# EAGLE design HMVCO1 (EAGLE 9.6.2)
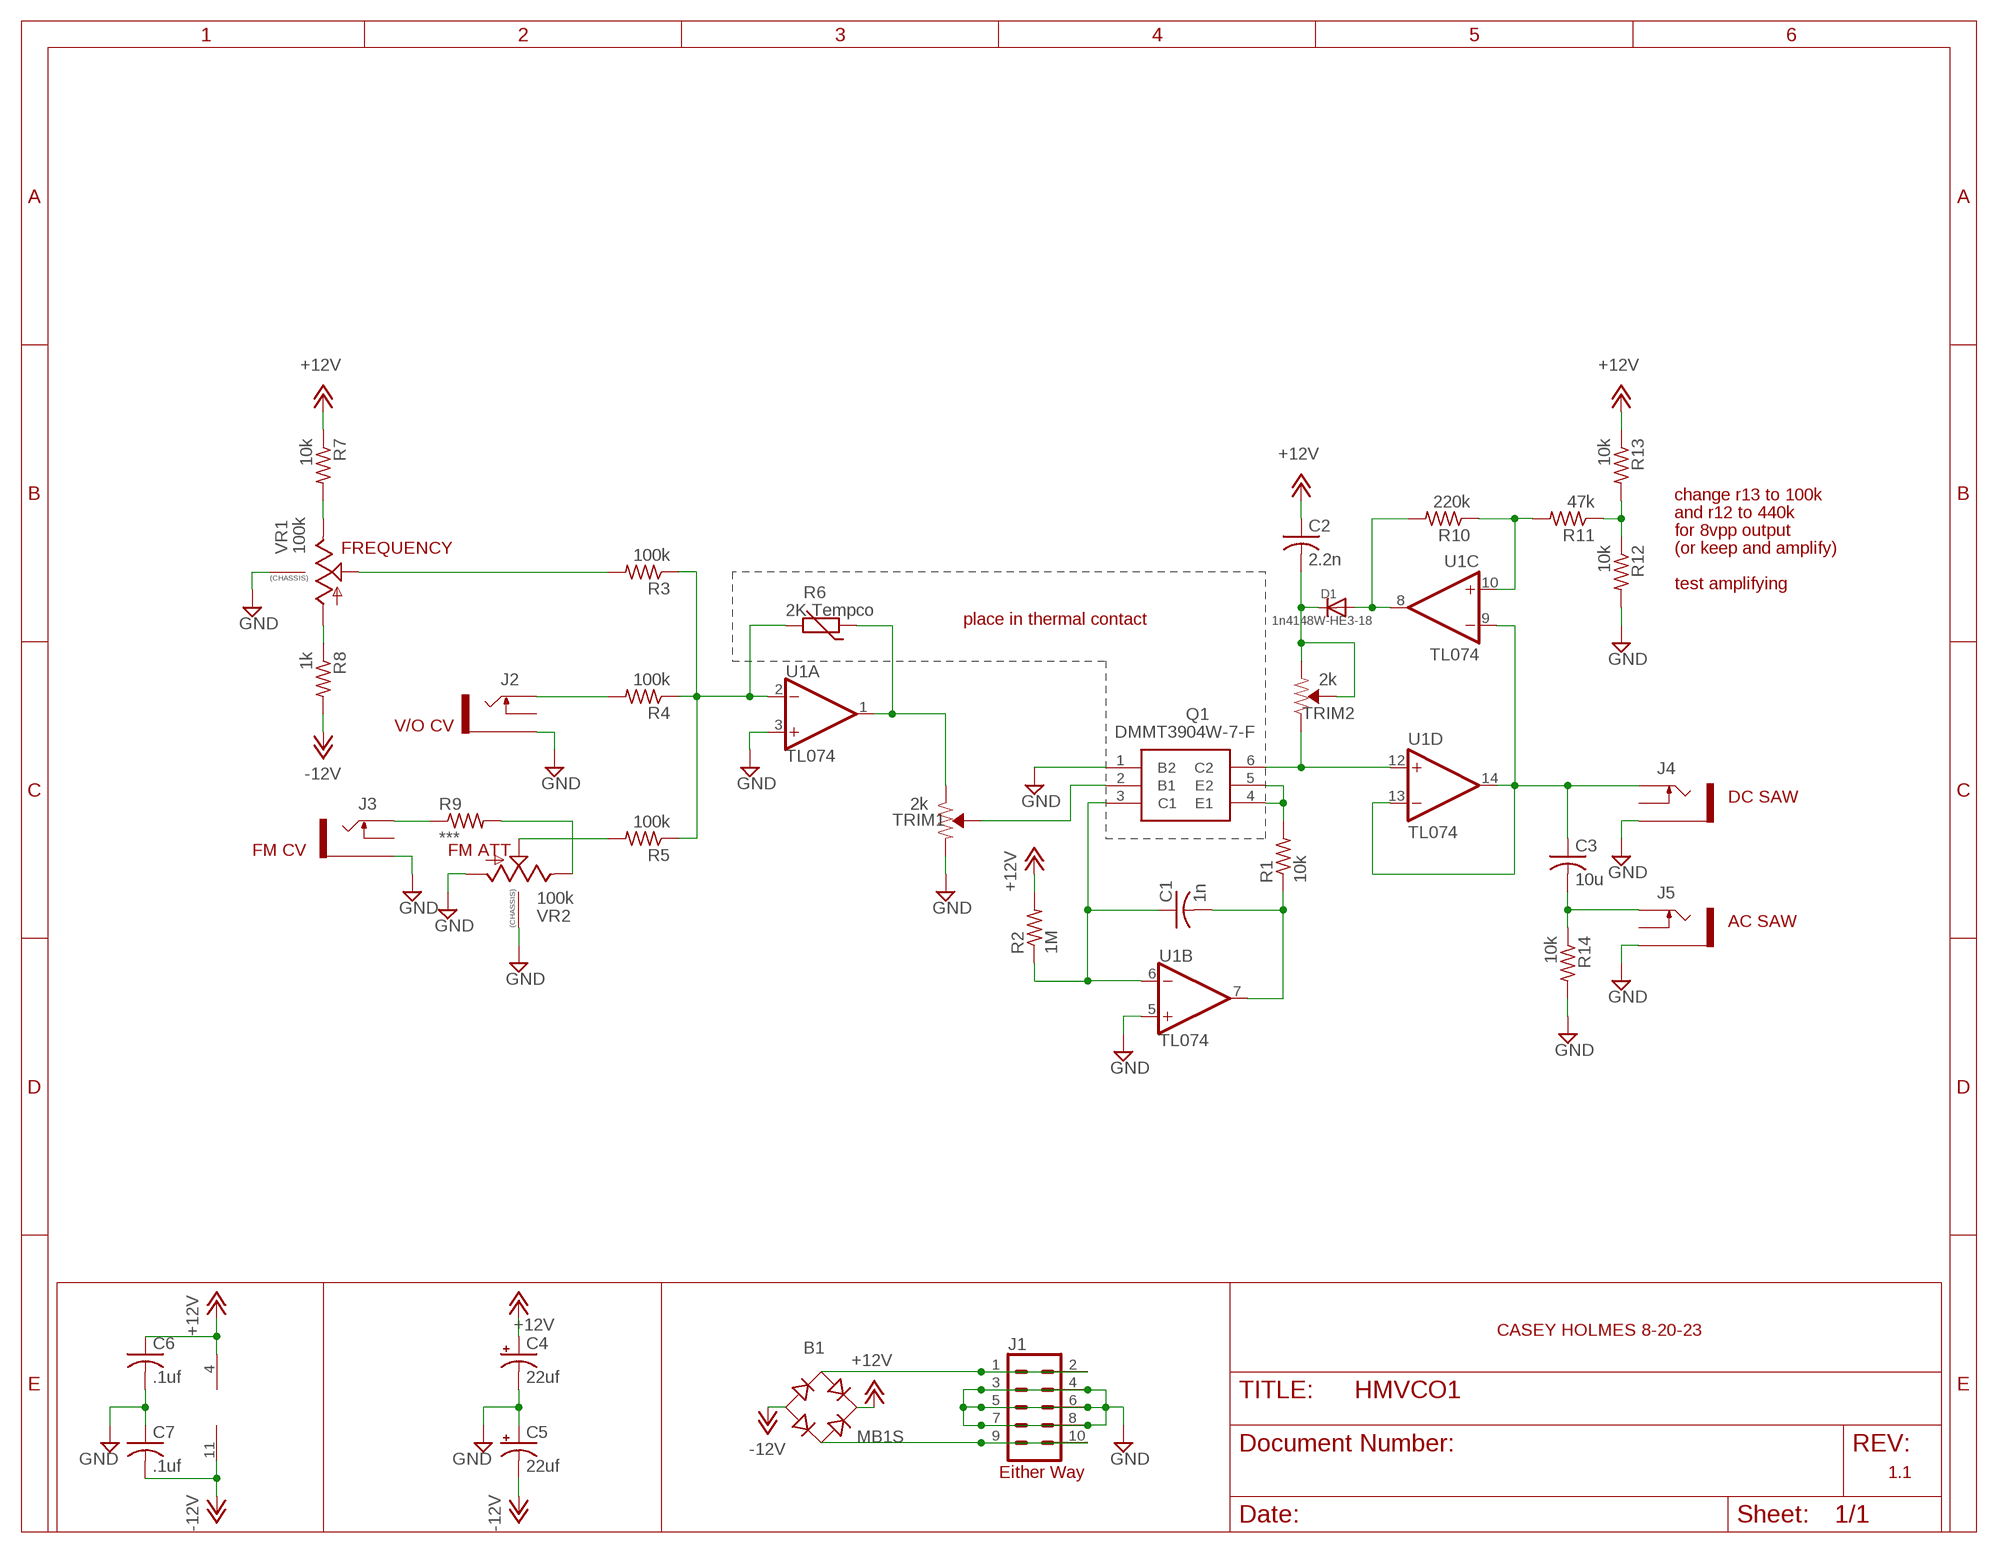
[diagram p0: schematic, sheet 1]

## Parts
B1  MB1S  [SOIC-4]
C1  1n  C-USC0603K  [C0603K]
C2  2.2n  C-USC0603K  [C0603K]
C3  10u  C-USC0603K  [C0603K]
C4  22uf  CPOL-USC  [PANASONIC_C]
C5  22uf  CPOL-USC  [PANASONIC_C]
C6  .1uf  C-USC0603K  [C0603K]
C7  .1uf  C-USC0603K  [C0603K]
D1  1n4148W-HE3-18  DIODESOD-123  [SOD-123]
J1  CONN_05X2PTH  [2X5]
J2  THONKICONNNEW  [WQP-PJ301M-12_JACK]
J3  THONKICONNNEW  [WQP-PJ301M-12_JACK]
J4  THONKICONNNEW  [WQP-PJ301M-12_JACK]
J5  THONKICONNNEW  [WQP-PJ301M-12_JACK]
Q1  DMMT3904W-7-F  [SOT65P210X100-6N]
R1  10k  R-US_R0603  [R0603]
R2  1M  R-US_R0603  [R0603]
R3  100k  R-US_R0603  [R0603]
R4  100k  R-US_R0603  [R0603]
R5  100k  R-US_R0603  [R0603]
R6  2K Tempco  THERMISTOR-5  [R-5]
R7  10k  R-US_R0603  [R0603]
R8  1k  R-US_R0603  [R0603]
R9  ***  R-US_R0603  [R0603]
R10  220k  R-US_R0603  [R0603]
R11  47k  R-US_R0603  [R0603]
R12  10k  R-US_R0603  [R0603]
R13  10k  R-US_R0603  [R0603]
R14  10k  R-US_R0603  [R0603]
TRIM1  2k  TRIMPOT-SMD-3MM-OPEN-1/10W-25%  [TRIMPOT-SMD-TC33X]
TRIM2  2k  TRIMPOT-SMD-3MM-OPEN-1/10W-25%  [TRIMPOT-SMD-TC33X]
U1  TL074  [TSSOP14]
VR1  100k  9MM_SNAP-IN_POT_CHASSIS  [9MM_SNAP-IN_POT]
VR2  100k  9MM_SNAP-IN_POT_CHASSIS  [9MM_SNAP-IN_POT]

## Nets
+12V: B1.+ C2.1 C4.+ C6.1 R2.2 R7.1 R13.1 U1.4(P:V+)
-12V: B1.- C5.- C7.2 R8.2 U1.11(P:V-)
GND: C4.- C5.+ C6.2 C7.1 J1.3 J1.4 J1.5 J1.6 J1.7 J1.8 J2.P$3_SLEEVE(SLEEVE) J3.P$3_SLEEVE(SLEEVE) J4.P$3_SLEEVE(SLEEVE) J5.P$3_SLEEVE(SLEEVE) Q1.1(B2) R12.2 R14.2 TRIM1.3(CCW) U1.3(A:+IN) U1.5(B:+IN) VR1.CHASSIS1 VR1.CHASSIS2 VR2.1(A) VR2.CHASSIS1 VR2.CHASSIS2
N$1: Q1.4(E1) Q1.5(E2) R1.2
N$2: Q1.2(B1) TRIM1.2(WIPER)
N$3: Q1.6(C2) TRIM2.1(CW) U1.12(D:+IN)
N$4: R6.1 TRIM1.1(CW) U1.1(A:OUT)
N$5: C1.1 Q1.3(C1) R2.1 U1.6(B:-IN)
N$6: R3.1 R4.1 R5.1 R6.2 U1.2(A:-IN)
N$7: C1.2 R1.1 U1.7(B:OUT)
N$8: J2.P$1_TIP(TIP) R4.2
N$9: R3.2 VR1.2(S)
N$10: R8.1 VR1.1(A)
N$11: R7.2 VR1.3(E)
N$12: R9.2 VR2.3(E)
N$13: R5.2 VR2.2(S)
N$14: J3.P$1_TIP(TIP) R9.1
N$15: C3.1 J4.P$1_TIP(TIP) U1.9(C:-IN) U1.13(D:-IN) U1.14(D:OUT)
N$16: C2.2 D1.C TRIM2.2(WIPER) TRIM2.3(CCW)
N$17: D1.A R10.2 U1.8(C:OUT)
N$18: R10.1 R11.2 U1.10(C:+IN)
N$19: R11.1 R12.1 R13.2
N$20: C3.2 J5.P$1_TIP(TIP) R14.1
N$24: B1.~2(AC2) J1.9 J1.10
N$25: B1.~1(AC1) J1.1 J1.2
Unconnected: J2.P$2_SWITCH(SWITCH) J3.P$2_SWITCH(SWITCH) J4.P$2_SWITCH(SWITCH) J5.P$2_SWITCH(SWITCH)

## Notes on the sheet
- change r13 to 100k
- and r12 to 440k
- for 8vpp output
- FREQUENCY | (or keep and amplify)
- test amplifying
- place in thermal contact
- V/O CV
- DC SAW
- FM CV | FM ATT
- AC SAW
- CASEY HOLMES 8-20-23
- Either Way | 1.1

## Library data of the parts
B1 = rectifier:MB*S: Bridge Rectifier Source: http://www.fairchildsemi.com/ds/MB/MB6S.pdf
C1-C3 C6 C7 = rcl:C-US: CAPACITOR, American symbol; SPICEPREFIX: C
C4 C5 = rcl:CPOL-US: POLARIZED CAPACITOR, American symbol; SPICEPREFIX: C
D1 = adafruit:DIODE: Diode SMADIODE - SMA Surface Mount Package 20V 1A Schottky Diode Digikey: 641-1014-6-ND DO-1N4148 - Through Hole Small Current Diode SOD-123 20V 1 A (.5mV Vf) Schottky Diode - Digikey: MBRX120TPMSCT-ND SOD-323 10V 570mA (.38mV Vf, 3ns) Schottky Diode - Digikey: ZLLS410CT-ND SOD-523 30V 30mA Schottky Diode (RB751S-40TE61) - Digikey: RB751S-40TE61CT-ND SOT23-R/W - SOT23 Package (R = Solder Paste/Reflow Ovens, W = Hand-Soldering) BAT54Film 40V 300mA - Digikey: 497-7162-1-ND
J1 = SparkFun-Connectors:CONN_05X2: Multi connection point. Often used as Generic Header-pin footprint for 0.1 inch spaced/style header connections For AVR SPI programming port, see special device with nice symbol: "AVR_SPI_PROG_5x2.dev" You can populate with any combo of single row headers, but if you'd like an exact match, check these: 2x5 AVR ICSP Male Header <https://www.sparkfun.com/products/778> (PRT-00778) 2x5 Pin Shrouded Header <https://www.sparkfun.com/products/8506> (PRT-08506) On any of the 0.1 inch spaced packages, you can populate with these: Break Away Headers - Straight <https://www.sparkfun.com/products/116> (PRT-00116) Break Away Male Headers - Right Angle <https://www.sparkfun.com/products/553> (PRT-00553) Female Headers <https://www.sparkfun.com/products/115> (PRT-00115) Break Away Headers - Machine Pin <https://www.sparkfun.com/products/117> (PRT-00117) Break Away Female Headers - Swiss Machine Pin <https://www.sparkfun.com/products/743> (PRT-00743) Special note: the shrouded connector mates well with our 5x2 ribbon cables: 2x5 Pin IDC Ribbon Cable <https://www.sparkfun.com/products/8535> (PRT-08535); PROD_ID: CONN-08499; SF_ID: PRT-0778
J2-J5 = MusicThingModular:THONKICONN: 3.5mm socket for Eurorack modular synths
Q1 = DMMT3904W-7-F:DMMT3904W-7-F: Diodes Inc DMMT3904W-7-F Dual NPN Bipolar Transistor, 200 mA, 40 V, 6-Pin SOT-363 Source: Datasheet <https://www.arrow.com/en/products/dmmt3904w-7-f/diodes-incorporated>; DESCRIPTION: Diodes Inc DMMT3904W-7-F Dual NPN Bipolar Transistor, 200 mA, 40 V, 6-Pin SOT-363; HEIGHT: 1mm; MANUFACTURER_NAME: Diodes Inc.; MANUFACTURER_PART_NUMBER: DMMT3904W-7-F; MOUSER_PART_NUMBER: 621-DMMT3904W-F; MOUSER_PRICE-STOCK: https://www.mouser.co.uk/ProductDetail/Diodes-Incorporated/DMMT3904W-7-F?qs=jL3InCUZRT6ej7BpU1jcgw%3D%3D
R1-R5 R7-R14 = rcl:R-US_: RESISTOR, American symbol; SPICEPREFIX: R
R6 = varistor:THERMISTOR: THERMISTOR
TRIM1 TRIM2 = SparkFun-Resistors:TRIMPOT: Trimming Potentiometer (Trimpot) Three-terminal potentiometers, with an adjustable wiper and two adjustable resistors. A pot can be used to create a configurable voltage divider, or as a variable resistor. "Trimpots" are a subset of potentiometers, usually intended for "set-and-forget" applications. They're often more delicate than standard potentiometers - rated for fewer turns. Variants PTH-KNOB - PTH Trimpot w/ finger-adjustable knob Trimpot 10K with Knob <https://www.sparkfun.com/products/9806> (COM-09806) Datasheet <http://www.sparkfun.com/datasheets/Components/General/TSR-3386.pdf> SMD-3MM-CLOSED-FRAME - SMD 3mm Square Closed-Frame Trimpot Used on e.g. EasyDriver - Stepper Motor Driver <https://www.sparkfun.com/products/12779> Datasheet <http://www.bitechnologies.com/pdfs/22.pdf> (22AR10KTR) SMD-5MM - SMD 5mm Square Closed-Frame Trimpot Used on e.g. IOIO-OTG - V2.2 <https://www.sparkfun.com/products/13613> Datasheet <http://www.vishay.com/docs/51008/ts53.pdf> (TS53YL502MR10) SMD-3MM-1/10W-25% - 3mm Square Open-Frame Trimpot Used on e.g. SparkFun Shapeoko <https://www.sparkfun.com/products/13899> Datasheet <http://www.bourns.com/docs/Product-Datasheets/TC33.pdf> (TC33X-2-103E); PROD_ID: RES-12428, RES-08048; VALUE: 10k
U1 = caseyslibrary:TL074: Generic Quad Op Amp
VR1 VR2 = MusicThingModular:9MM_SNAP-IN_POT_CHASSIS: 9mm vertical snap-in pot, Alpha / Panasonic style, with a connection to the metal chassis for grounding

## Board
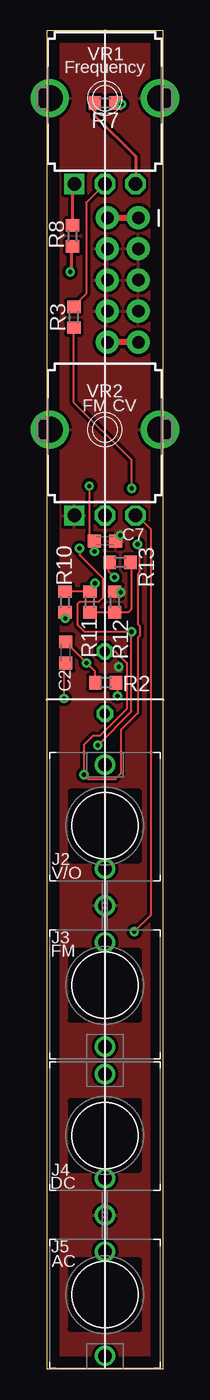
[diagram p1: board, top side]
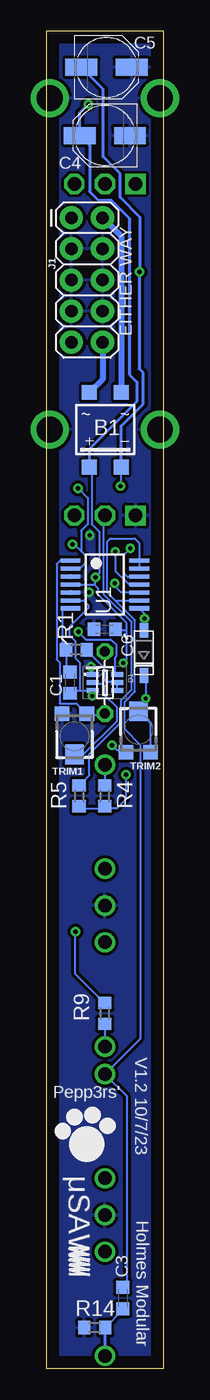
[diagram p2: board, bottom side, seen from below]

Size 9.53 x 109.21 mm. Coordinates in mm from the lower left corner, seen from the top.
Outline: 0,0 9.53,0 9.53,109.21 0,109.21 0,0
Copper layers (1*16): Top 0.035mm / dielectric 1.5mm / Bottom 0.035mm
Design rules "default": minimum track width 6mil, minimum drill 0.35mm, track to track 6mil, track to pad 6mil, pad to pad 6mil, via to via 6mil, smd to smd 6mil, copper to edge 40mil, drill to drill 6mil, minimum pad ring 10mil, minimum via ring 8mil, stop-mask expansion 4mil, vias tented up to drill 0mil, thermal gap 10mil

### Footprints (pad centres in the part's own frame; a part is rotated, then mirrored left to right if it is on the bottom)
SOIC-4 = smd 1.2 x 1.2: + 1.3,3.05; - -1.3,3.05; ~1 -1.3,-3.05; ~2 1.3,-3.05
C0603K = smd 1.05 x 1.08: 1 -0.875,0; 2 0.875,0
PANASONIC_C = smd 2.6 x 1.4: + 2.05,0; - -2.05,0
SOD-123 = smd 1.2 x 0.7: A 1.85,0; C -1.85,0
2X5 = drill 1.016 pad 1.88: 1 0,0; 2 0,2.54; 3 2.54,0; 4 2.54,2.54; 5 5.08,0; 6 5.08,2.54; 7 7.62,0; 8 7.62,2.54; 9 10.16,0; 10 10.16,2.54
WQP-PJ301M-12_JACK = drill 1.1: P$1_TIP 0,5; P$2_SWITCH 0,-3.5; P$3_SLEEVE 0,-6.5
SOT65P210X100-6N = smd 1 x 0.4: 1 -1,0.65; 2 -1,0; 3 -1,-0.65; 4 1,-0.65; 5 1,0; 6 1,0.65
R0603 = smd 1 x 1.1: 1 -0.85,0; 2 0.85,0
R-5 = drill 0.813 octagon: 1 -2.54,0; 2 2.54,0
TRIMPOT-SMD-TC33X = smd 1.2 x 1.2: 1 -1,-1.825; 3 1,-1.825 | smd 1.5 x 1.6: 2 0,1.5
TSSOP14 = smd 0.35 x 1.6: 1 -1.95,-2.8; 2 -1.3,-2.8; 3 -0.65,-2.8; 4 0,-2.8; 5 0.65,-2.8; 6 1.3,-2.8; 7 1.95,-2.8; 8 1.95,2.8; 9 1.3,2.8; 10 0.65,2.8; 11 0,2.8; 12 -0.65,2.8; 13 -1.3,2.8; 14 -1.95,2.8
9MM_SNAP-IN_POT = drill 1.1 square: 1 -2.5,-7 | drill 1.1 octagon: 2 0,-7; 3 2.5,-7 | drill 2.1 pad 2.794: CHASSIS1 -4.5,0; CHASSIS2 4.5,0

### Placement (x,y rotation side)
B1  4.74,76.64 180 bottom
C1  7.61,56.01 90 bottom
C2  1.56,58.46 270 top
C3  3.3,5.78 270 bottom
C4  4.76,100.65 180 bottom
C5  4.64,106.22 0 bottom
C6  4.78,60.36 180 bottom
C7  4.76,67.56 180 top
D1  1.59,58.43 90 bottom
J1  7.5,93.94 270 bottom
J2  4.76,44.31 0 top
J3  4.76,31.31 180 top
J4  4.76,19.05 0 top
J5  4.76,6.06 180 top
Q1  4.76,56.01 0 bottom
R1  7.09,58.7 0 bottom
R2  4.83,56.01 180 top
R3  2.22,85.81 90 top
R4  4.78,46.76 90 bottom
R5  6.86,46.76 90 bottom
R6  4.76,56.01 90 bottom
R7  4.78,103.31 180 top
R8  2.12,92.46 270 top
R9  4.78,29.01 90 bottom
R10  1.51,62.59 270 top
R11  3.53,62.59 90 top
R12  5.57,62.59 90 top
R13  6.01,65.81 0 top
R14  5.59,3.37 180 bottom
TRIM1  7.25,51.64 180 bottom
TRIM2  2.03,52.16 0 bottom
U1  4.76,64.01 270 bottom
VR1  4.76,103.7 0 top
VR2  4.76,76.64 0 top

### Tracks (layer width: path | path; a pad name or v marks a point on that pad's centre or on a via)
+12V  (via drill 0.35)
  Top 0.152: R2.2 3.81,55.88 3.96,55.88 3.96,56.91 v3.26,57.61 3.27,57.62 1.56,59.33 C2.1 | R13.1 5.04,65.7 5.04,65.1 v5.54,64.61
  Top 0.254: v6.11,103.21 6.01,103.31 5.96,103.31 R7.1
  Bottom 0.152: 5.54,63.92 5.63,64.01 U1.4 | 5.54,63.92 5.35,63.73 5.35,63.25 3.02,60.92 3.02,60.31 | 5.54,63.92 v5.54,64.61 5.24,64.91 5.24,68.33 5.85,68.94 5.85,73.4 B1.+ | 3.02,60.31 3.02,57.85 v3.26,57.61 | C6.1 3.85,60.31 3.02,60.31
  Bottom 0.254: v6.11,103.21 6.81,102.51 C4.+ 6.02,99.85 6.02,96.08 5.32,95.38 4.25,95.38 2.73,93.85 2.73,81.11 2.16,80.54 2.16,78.95 6.04,75.08 B1.+
-12V  (via drill 0.35)
  Top 0.152: v3.91,66.7 3.91,67.54 C7.2 3.5,67.95 3.5,72.03 v3.49,72.05
  Top 0.254: R8.2 2.03,91.52 2.03,89.62 v1.93,89.52
  Bottom 0.152: U1.11 2.79,64.01 3.91,65.13 v3.91,66.7 | v3.49,72.05 3.47,72.03 3.47,73.56 B1.-
  Bottom 0.254: C5.- 4.9,104.44 4.9,98.91 3.53,97.53 3.53,95.61 1.93,94 v1.93,89.52 1.97,89.52 1.97,81.62 1.64,81.29 1.64,78.74 3.44,76.94 B1.-
GND  (via drill 0.35)
  other vias: 6.06,63.37 6.01,68.03 5.89,57.3
  pour Top (isolate 0.254): 9.53,109.22 0,109.22 0,0 9.53,0
  pour Bottom (isolate 0.254): 9.53,0 0,0 0,109.22 9.53,109.22
N$1
  Bottom 0.152: Q1.4 3.81,55.4 3.81,55.88 Q1.5 3.81,56.04 4.62,56.04 4.8,56.22 4.8,57.2 6.04,58.43 R1.2
N$2
  Bottom 0.152: Q1.2 5.71,55.88 4.97,55.88 4.81,55.72 4.81,54.99 3.77,53.96 3.77,52.88 6.51,50.14 TRIM1.2
N$3  (via drill 0.35)
  Top 0.152: v4.18,50.89 6.93,53.64 v6.93,60.15 3.11,60.15 2.55,60.71 2.55,62.46 2.7,62.6 4.28,62.6 4.63,62.96 4.63,64.48 2.69,66.42 v2.69,66.97
  Bottom 0.152: v6.93,60.15 6.31,59.53 4.29,59.53 3.81,59.05 3.81,58.17 3.94,58.04 3.94,56.83 Q1.6 | v4.18,50.89 3.81,50.52 3.19,50.52 TRIM2.1 | v2.69,66.97 v2.69,66.96 3.25,66.41 3.25,64.95 2.96,64.67 1.97,64.67 U1.12
N$4
  Bottom 0.152: 6.17,53.4 6.1,53.34 5.08,53.34 R6.1 | 6.17,53.4 TRIM1.1 | U1.1 8.4,65.96 8.7,65.66 8.7,57.9 8.46,57.66 8.46,54.32 7.09,54.32 6.17,53.4
N$5  (via drill 0.35)
  Top 0.152: R2.1 5.78,55.9 5.78,54.93 v5.79,54.91
  Bottom 0.152: 6.8,55.37 7.37,55.37 C1.1 | 6.8,55.37 5.78,55.37 Q1.3 5.79,55.33 v5.79,54.91 | U1.6 7.46,62.71 6.5,62.71 6.12,62.32 6.12,62.08 7.61,60.58 7.61,59.84 7.14,59.37 7.14,57.97 6.8,57.63 6.8,55.37
N$6  (via drill 0.35)
  Top 0.152: R3.1 2.2,84.96 2.2,78.91 6.95,74.16 v6.95,71.87 | R6.2 5.63,58.55 6.56,57.61 6.56,53.85 4.4,51.69 3.81,51.69 3.05,50.93 v3.05,48.49 3.4,48.13 5.61,48.13 6.11,48.63 6.11,52.18 7.44,53.52 7.44,59.66 7.61,59.83 7.61,60.61 7.44,60.78 7.44,64.87 7.61,65.04 7.61,67.06 7.42,67.25 v7.42,67.28
  Bottom 0.152: 5.08,45.72 6.35,45.72 R5.1 | 5.08,45.72 3.81,45.72 3.05,46.48 v3.05,48.49 | 5.08,45.72 R4.1 | U1.2 6.79,65.3 6.31,65.79 6.31,66.33 6.69,66.72 | v6.95,71.87 6.15,71.08 6.15,68.94 6.69,68.4 6.69,66.72 | v7.42,67.28 7.4,67.27 7.25,67.27 6.69,66.72
N$7
  Bottom 0.152: C1.2 7.92,57.2 7.92,58.69 R1.1 8.26,59.02 8.26,62.06 U1.7
N$8
  Bottom 0.152: J2.P$1_TIP 4.76,47.62 R4.2
N$9
  Top 0.152: VR1.2 3.24,95.17 3.24,87.74 2.22,86.73 R3.2
N$10
  Top 0.254: R8.1 2.12,96.55 VR1.1
N$11
  Top 0.254: VR1.3 7.26,98.95 3.92,102.29 R7.2
N$12  (via drill 0.35)
  Top 0.152: v7.16,35.69 8.53,37.06 8.53,68.51 7.4,69.64 VR2.3
  Bottom 0.152: R9.2 4.8,29.86 7.16,32.22 v7.16,35.69 | v7.16,35.69
N$13
  Bottom 0.152: VR2.2 4.76,69.61 4.89,69.48 4.89,63.25 2.62,60.97 2.62,55.4 3.47,54.55 3.47,52.76 3.5,52.72 | R5.2 6.03,48.44 6.03,50.19 3.5,52.72 | 3.5,52.72
N$14
  Bottom 0.152: R9.1 J3.P$1_TIP
N$15
  Bottom 0.152: U1.14 U1.13 | C3.1 3,6.96 3,22.29 J4.P$1_TIP 1.88,26.93 1.88,50.93 3.16,52.21 3.16,54.42 2.31,55.27 2.31,61.1 3.9,62.69 3.9,62.7 | 3.9,62.7 1.97,62.7 U1.9 | 3.9,62.7 3.91,62.7 4.58,63.37 4.58,67.5 4.32,67.76 2.32,67.76 1.96,67.41 U1.14 | U1.14
N$16  (via drill 0.35)
  Top 0.152: C2.2 1.42,57.45 v1.42,54.71
  Bottom 0.152: D1.C 1.59,56.48 1.42,56.31 v1.42,54.71 1.42,54.27 TRIM2.2 1.03,52.66 TRIM2.3
N$17  (via drill 0.35)
  Top 0.152: R10.2 1.51,61.25 v1.52,61.24
  Bottom 0.152: D1.A 1.52,60.35 v1.52,61.24 1.52,61.62 U1.8
N$18  (via drill 0.35)
  Top 0.152: v3.95,64.1 3.95,63.86 R11.2 R10.1
  Bottom 0.152: U1.10 3.44,63.36 3.95,63.87 v3.95,64.1
N$19
  Top 0.152: R11.1 R12.1 6.66,61.74 6.89,61.98 6.89,65.77 R13.2
N$20
  Bottom 0.152: R14.1 3.3,4.8 C3.2
  Bottom 0.254: J5.P$1_TIP 4.74,1.08 R14.1
N$24
  Top 0.508: J1.9 J1.10
  Bottom 0.508: J1.10 4.96,80.75 6.01,79.69 B1.~2
N$25
  Top 0.508: J1.2 J1.1
  Bottom 0.508: J1.2 3.44,92.42 B1.~1

### Text on the board
tNames: Frequency | FM CV | V/O | FM | DC | AC
bNames: EITHER WAY | . | V1.2 10/7/23 | Pepp3rs' | μSAW | Holmes Modular
bStop: CH